# EAGLE design MS5803_Breakout (EAGLE 9.4.2)
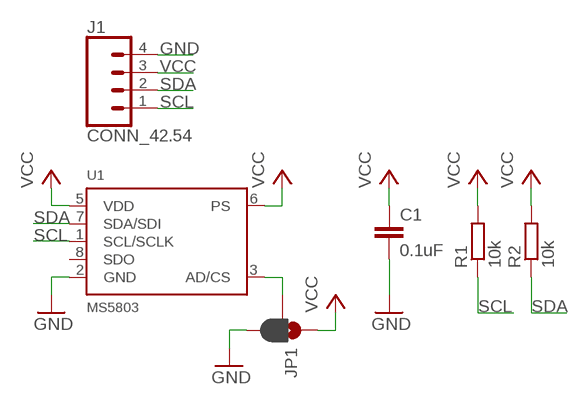
[diagram p0: schematic, sheet 1]

## Parts
C1  0.1uF  C-EUC0805  [C0805]
J1  CONN_42.54  [1X04]
JP1  JUMPER-SMT_3_1-NC_PASTE_SILK  [SMT-JUMPER_3_1-NC_PASTE_SILK]
R1  10k  R-EU_P1MR0805  [R0805]
R2  10k  R-EU_P1MR0805  [R0805]
U1  MS5803  [MS5803]

## Nets
GND: C1.2 J1.4 JP1.3 U1.2(GND)
N$1: JP1.2 U1.3(AD/CS)
SCL: J1.1 R1.1 U1.1(SCL/SCLK)
SDA: J1.2 R2.1 U1.7(SDA/SDI)
VCC: C1.1 J1.3 JP1.1 R1.2 R2.2 U1.5(VDD) U1.6(PS)
Unconnected: U1.8(SDO)

## Library data of the parts
C1 = bschulz_passives:C-EU: CAPACITOR, European symbol
J1 = bschulz:CONN_4: Genaric 4 terminal header Digikey 2.54_SCREW <https://www.digikey.com/product-detail/en/on-shore-technology-inc/OSTVN04A150/ED10563-ND/1588864>
JP1 = SparkFun-Jumpers:JUMPER-SMT_3_1-NC_PASTE: Normally closed solder jumper (1 of 2 connections) This jumper has an aperture in the stencil to allow solder paste to bridge one of the two connections. One connection is normally closed (NC), while the other is normally open (NO). Wick off the solder to open the connection. Reapply solder to reclose the connection. Apply solder to the other side instead to change the current path.
R1 R2 = bschulz_passives:R-EU_: RESISTOR, European symbol Digikey Parts: Yageo, 0402 <https://www.digikey.com/products/en/resistors/chip-resistor-surface-mount/52?k=&pkeyword=&sf=0&FV=ffec1104%2Cfffc000d%2C1c0002%2C440067%2C1f140000%2Cffe00034%2C400004&quantity=&ColumnSort=0&page=1&stock=1&pageSize=25> Yageo, 0603 <https://www.digikey.com/products/en/resistors/chip-resistor-surface-mount/52?k=&pkeyword=&s=4356&s=47360&sf=0&FV=fffc000d%2C1c0002%2C142c040c%2C1f140000%2Cffe00034&quantity=10&ColumnSort=1000011&page=1&stock=1&pageSize=25> Panasonic, 0603 <https://www.digikey.com/products/en/resistors/chip-resistor-surface-mount/52?k=&pkeyword=&pv252=68&sf=0&FV=ffec373d%2C1c0002%2C142c040c%2C1f140000%2Cffe00034%2C80002%2Cc0001&quantity=&ColumnSort=0&page=1&stock=1&pageSize=25> Panasonic, precision, 0603 <https://www.digikey.com/products/en/resistors/chip-resistor-surface-mount/52?FV=ffec4907%2Cfffc000a%2Cc0172%2C142c040c%2C1f140000%2Cffe00034%2C1c0002&quantity=100&ColumnSort=2085&page=1&stock=1&pageSize=25> Panasonic, 0805 <https://www.digikey.com/products/en/resistors/chip-resistor-surface-mount/52?k=&pkeyword=&pv3=1&sf=0&FV=ffec373d%2C1c0002%2C1f140000%2Cffe00034%2C142c040d&quantity=&ColumnSort=0&page=1&stock=1&pageSize=25> Rohm, current sense <https://www.digikey.com/products/en/resistors/chip-resistor-surface-mount/52?k=&pkeyword=&pv3=1&sf=0&FV=ffecb688%2C1f140000%2Cffe00034%2C1c0002&quantity=&ColumnSort=0&page=1&stock=1&pageSize=25> Vishay, pulse proof automotive <https://www.digikey.com/products/en/resistors/chip-resistor-surface-mount/52?k=&pkeyword=&pv7=2&sf=0&FV=ffec5d6b%2Cffe00034%2C1f140000&quantity=&ColumnSort=0&page=1&stock=1&pageSize=25>; DIGIKEY: P1MDACT-ND; MF: Panasonic; MPN: ERA-6AEB105V
U1 = bschulz:MS5803; PROD_ID: IC-12111

## Board
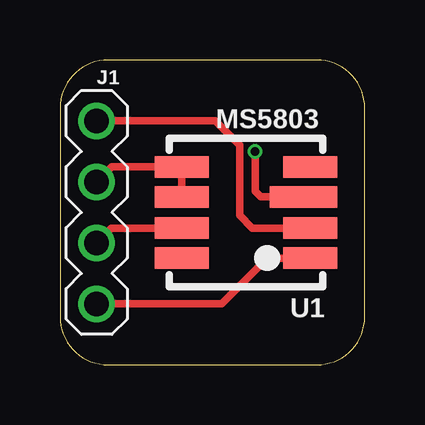
[diagram p1: board, top side]
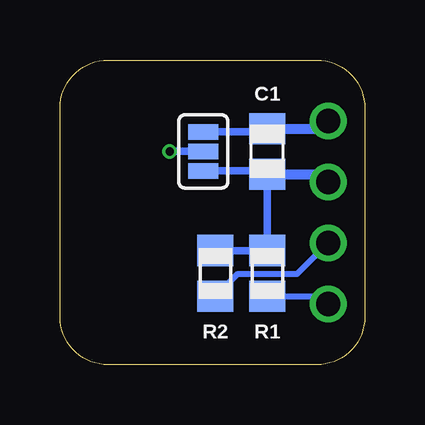
[diagram p2: board, bottom side, seen from below]

Size 12.7 x 12.7 mm. Coordinates in mm from the lower left corner, seen from the top.
Outline: 10.7,12.7 2,12.7 arc90 0,10.7 0,2 arc90 2,0 10.7,0 arc90 12.7,2 12.7,10.7 arc90 10.7,12.7
Copper layers (1*16): Top 0.035559375mm / dielectric 1.6mm / Bottom 0.035559375mm
Design rules "oshpark-2layer": minimum track width 6mil, minimum drill 10mil, track to track 6mil, track to pad 6mil, pad to pad 6mil, via to via 6mil, smd to smd 6mil, copper to edge 15mil, drill to drill 6mil, minimum pad ring 5mil, minimum via ring 5mil, stop-mask expansion 2.5mil, vias tented up to drill 0mil, thermal gap 10mil

### Footprints (pad centres in the part's own frame; a part is rotated, then mirrored left to right if it is on the bottom)
C0805 = smd 1.3 x 1.5: 1 -0.95,0; 2 0.95,0
1X04 = drill 1.016: 1 -3.81,0; 2 -1.27,0; 3 1.27,0; 4 3.81,0
SMT-JUMPER_3_1-NC_PASTE_SILK = smd 0.635 x 1.27: 1 -0.813,0; 2 0,0; 3 0.813,0
R0805 = smd 1.3 x 1.5: 1 -0.95,0; 2 0.95,0
MS5803 = smd 2.25 x 0.9: 1 -2.675,1.9; 2 -2.675,0.65; 4 -2.675,-1.9; 5 2.675,-1.9; 6 2.675,-0.65; 7 2.675,0.65; 8 2.675,1.9 | smd 2.8 x 0.9: 3 -2.4,-0.65

### Placement (x,y rotation side)
C1  4.06,8.89 90 bottom
J1  1.52,6.35 90 top
JP1  6.73,8.89 90 bottom
R1  4.06,3.81 90 bottom
R2  6.22,3.81 90 bottom
U1  7.75,6.35 180 top

### Tracks (layer width: path | path; a pad name or v marks a point on that pad's centre or on a via)
GND
  Top 0.305: U1.2 8.02,5.7 7.49,6.22 7.49,9.14 6.48,10.16 J1.4
  Bottom 0.305: JP1.3 4.2,9.7 C1.2
  Bottom 0.406: C1.2 1.84,9.84 J1.4
N$1  (via drill 0.35)
  Top 0.305: U1.3 8.37,7 8.13,7.24 v8.13,8.89
  Bottom 0.305: v8.13,8.89 JP1.2
SCL
  Top 0.305: U1.1 8.64,4.45 6.73,2.54 J1.1
  Bottom 0.254: R1.1 1.84,2.86 J1.1
SDA
  Top 0.305: U1.7 2.14,5.7 J1.2
  Bottom 0.254: R2.1 5.29,3.79 2.81,3.79 J1.2
VCC
  Top 0.305: U1.6 U1.5 2.15,8.25 J1.3
  Bottom 0.305: JP1.1 4.2,8.08 C1.1 R1.2 R2.2
  Bottom 0.406: C1.1 1.84,7.94 J1.3

### Text on the board
bDocu: 0x77 | ADR | 0x76 | B. Schulz / Break 44